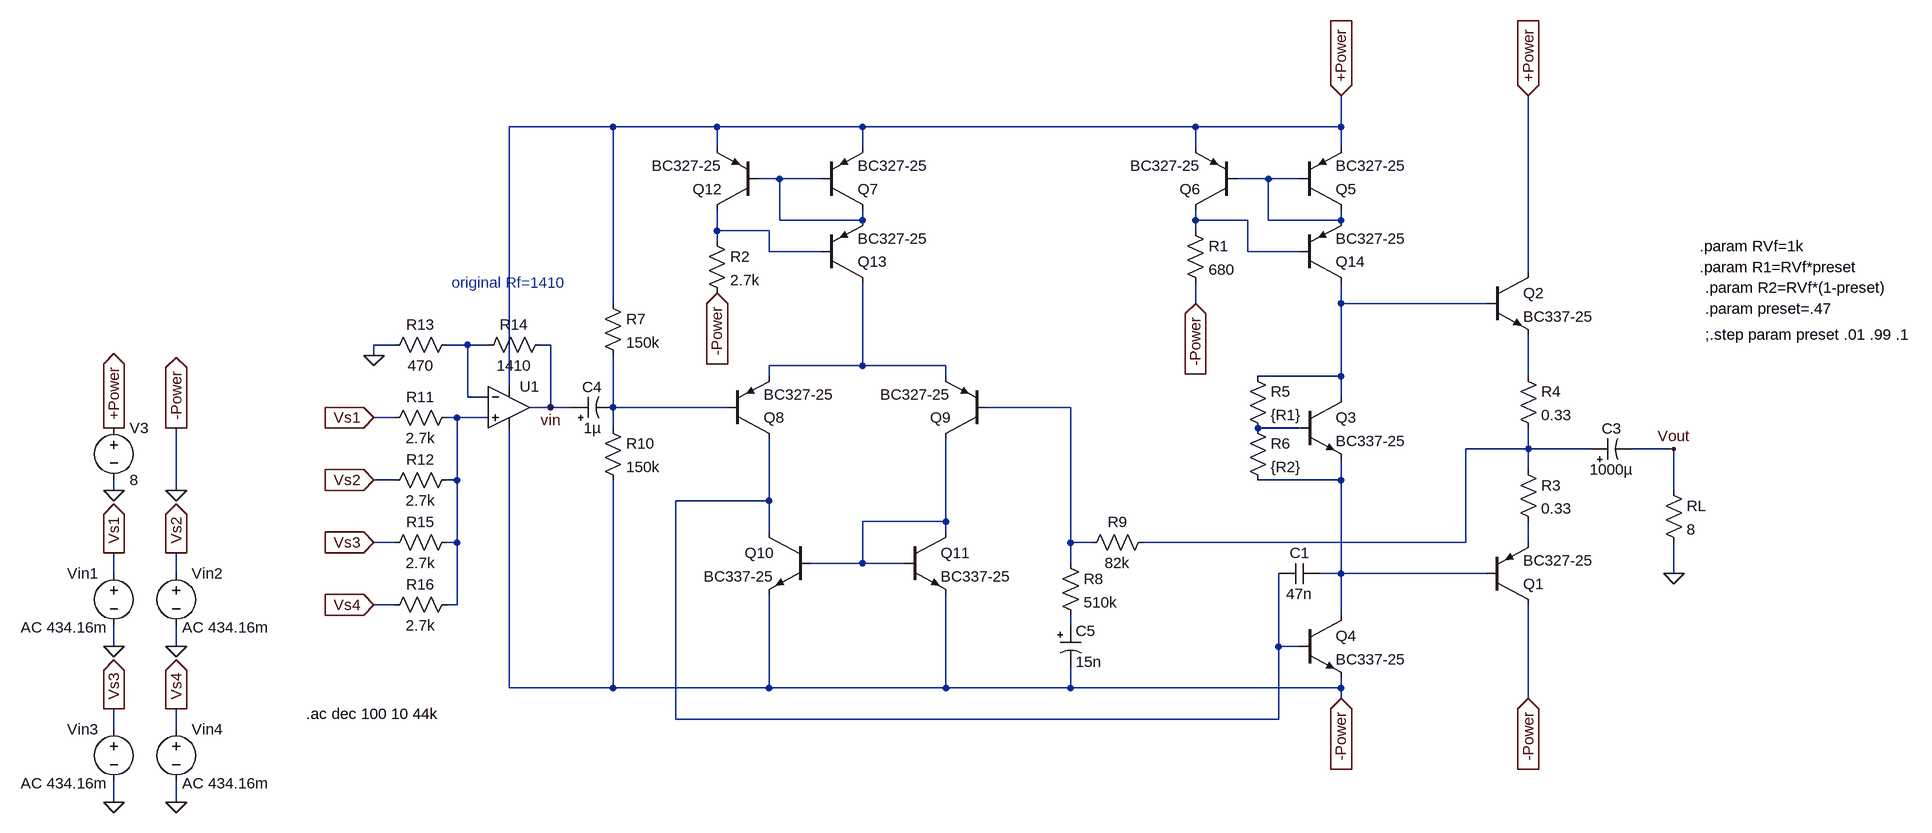
[diagram p0: schematic Headphones Amp Freq.asc]
Headphones Amp Freq.asc, the LTspice schematic file:
Version 4.1
SHEET 1 7092 1032
WIRE -624 -448 -784 -448
WIRE -464 -448 -624 -448
WIRE -240 -448 -464 -448
WIRE 272 -448 -240 -448
WIRE 496 -448 496 -496
WIRE 496 -448 272 -448
WIRE -464 -416 -464 -448
WIRE -240 -416 -240 -448
WIRE 272 -416 272 -448
WIRE 496 -416 496 -448
WIRE -368 -368 -400 -368
WIRE -304 -368 -368 -368
WIRE 384 -368 336 -368
WIRE 432 -368 384 -368
WIRE -368 -304 -368 -368
WIRE -240 -304 -240 -320
WIRE -240 -304 -368 -304
WIRE 272 -304 272 -320
WIRE 352 -304 272 -304
WIRE 384 -304 384 -368
WIRE 496 -304 496 -320
WIRE 496 -304 384 -304
WIRE -464 -288 -464 -320
WIRE -384 -288 -464 -288
WIRE 272 -288 272 -304
WIRE -464 -272 -464 -288
WIRE -384 -256 -384 -288
WIRE -304 -256 -384 -256
WIRE 352 -256 352 -304
WIRE 432 -256 352 -256
WIRE 784 -224 784 -496
WIRE -624 -176 -624 -448
WIRE 272 -176 272 -208
WIRE 496 -176 496 -208
WIRE 720 -176 496 -176
WIRE -960 -112 -992 -112
WIRE -848 -112 -880 -112
WIRE -816 -112 -848 -112
WIRE -720 -112 -736 -112
WIRE -992 -96 -992 -112
WIRE -240 -80 -240 -208
WIRE -240 -80 -384 -80
WIRE -112 -80 -240 -80
WIRE -384 -64 -384 -80
WIRE -112 -64 -112 -80
WIRE 496 -64 496 -176
WIRE 496 -64 368 -64
WIRE 784 -64 784 -128
WIRE -784 -48 -784 -448
WIRE -848 -32 -848 -112
WIRE -816 -32 -848 -32
WIRE 496 -32 496 -64
WIRE -720 -16 -720 -112
WIRE -720 -16 -752 -16
WIRE -688 -16 -720 -16
WIRE -624 -16 -624 -96
WIRE -624 -16 -640 -16
WIRE -448 -16 -624 -16
WIRE 80 -16 -48 -16
WIRE -960 0 -992 0
WIRE -864 0 -880 0
WIRE -816 0 -864 0
WIRE -624 16 -624 -16
WIRE 432 16 368 16
WIRE 784 48 784 16
WIRE 784 48 688 48
WIRE 880 48 784 48
WIRE 1008 48 944 48
WIRE 784 80 784 48
WIRE -960 96 -992 96
WIRE -864 96 -864 0
WIRE -864 96 -880 96
WIRE 496 96 496 64
WIRE 496 96 368 96
WIRE -1392 112 -1392 96
WIRE -1296 112 -1296 16
WIRE 1008 112 1008 48
WIRE -384 128 -384 32
WIRE -384 128 -528 128
WIRE -112 160 -112 32
WIRE -112 160 -240 160
WIRE -384 176 -384 128
WIRE -112 176 -112 160
WIRE -960 192 -992 192
WIRE -864 192 -864 96
WIRE -864 192 -880 192
WIRE 80 192 80 -16
WIRE 112 192 80 192
WIRE 688 192 688 48
WIRE 688 192 192 192
WIRE 784 192 784 160
WIRE -240 224 -240 160
WIRE -240 224 -320 224
WIRE -176 224 -240 224
WIRE 80 224 80 192
WIRE -1392 240 -1392 208
WIRE -1296 240 -1296 208
WIRE 496 240 496 96
WIRE 496 240 464 240
WIRE 720 240 496 240
WIRE 1008 240 1008 192
WIRE -960 288 -992 288
WIRE -864 288 -864 192
WIRE -864 288 -880 288
WIRE 496 304 496 240
WIRE 80 320 80 304
WIRE -1392 352 -1392 320
WIRE -1296 352 -1296 320
WIRE 400 352 400 240
WIRE 432 352 400 352
WIRE -784 416 -784 16
WIRE -624 416 -624 96
WIRE -624 416 -784 416
WIRE -384 416 -384 272
WIRE -384 416 -624 416
WIRE -112 416 -112 272
WIRE -112 416 -384 416
WIRE 80 416 80 384
WIRE 80 416 -112 416
WIRE 496 416 496 400
WIRE 496 416 80 416
WIRE 496 432 496 416
WIRE 784 432 784 288
WIRE -528 464 -528 128
WIRE 400 464 400 352
WIRE 400 464 -528 464
WIRE -1392 480 -1392 448
WIRE -1296 480 -1296 448
WIRE -1392 592 -1392 560
WIRE -1296 592 -1296 560
FLAG -1296 16 -Power
IOPIN -1296 16 Out
FLAG -1392 16 +Power
IOPIN -1392 16 Out
FLAG -1392 112 0
FLAG -1296 112 0
FLAG -1392 352 0
FLAG -1392 208 Vs1
IOPIN -1392 208 Out
FLAG 496 -496 +Power
IOPIN 496 -496 In
FLAG 784 -496 +Power
IOPIN 784 -496 In
FLAG 784 432 -Power
IOPIN 784 432 In
FLAG 1008 240 0
FLAG -992 0 Vs1
IOPIN -992 0 In
FLAG 496 432 -Power
IOPIN 496 432 In
FLAG 1008 48 Vout
FLAG -1296 352 0
FLAG -1296 208 Vs2
IOPIN -1296 208 Out
FLAG -992 96 Vs2
IOPIN -992 96 In
FLAG -992 -96 0
FLAG -1392 592 0
FLAG -1392 448 Vs3
IOPIN -1392 448 Out
FLAG -1296 592 0
FLAG -1296 448 Vs4
IOPIN -1296 448 Out
FLAG -992 192 Vs3
IOPIN -992 192 In
FLAG -992 288 Vs4
IOPIN -992 288 In
FLAG -720 -16 vin
FLAG 272 -176 -Power
IOPIN 272 -176 In
FLAG -464 -192 -Power
IOPIN -464 -192 In
SYMBOL voltage -1392 0 R0
WINDOW 123 0 0 Left 0
WINDOW 39 0 0 Left 0
SYMATTR InstName V3
SYMATTR Value 8
SYMBOL voltage -1392 224 M0
WINDOW 123 0 0 Left 0
WINDOW 39 0 0 Left 0
WINDOW 3 9 99 Left 2
SYMATTR Value AC 434.16m
SYMATTR InstName Vin1
SYMBOL res 992 96 R0
SYMATTR InstName RL
SYMATTR Value 8
SYMBOL res 768 64 R0
SYMATTR InstName R3
SYMATTR Value 0.33
SYMBOL res 768 -80 R0
SYMATTR InstName R4
SYMATTR Value 0.33
SYMBOL pnp 720 288 M180
SYMATTR InstName Q1
SYMATTR Value BC327-25
SYMBOL npn 720 -224 R0
SYMATTR InstName Q2
SYMATTR Value BC337-25
SYMBOL npn 432 -32 R0
SYMATTR InstName Q3
SYMATTR Value BC337-25
SYMBOL res 352 -80 R0
SYMATTR InstName R5
SYMATTR Value {R1}
SYMBOL res 352 0 R0
SYMATTR InstName R6
SYMATTR Value {R2}
SYMBOL npn 432 304 R0
SYMATTR InstName Q4
SYMATTR Value BC337-25
SYMBOL cap 464 224 R90
WINDOW 0 0 32 VBottom 2
WINDOW 3 32 32 VTop 2
SYMATTR InstName C1
SYMATTR Value 47n
SYMBOL pnp 432 -320 M180
SYMATTR InstName Q5
SYMATTR Value BC327-25
SYMBOL pnp 336 -320 R180
SYMATTR InstName Q6
SYMATTR Value BC327-25
SYMBOL res 256 -304 R0
SYMATTR InstName R1
SYMATTR Value 680
SYMBOL pnp -448 32 M180
SYMATTR InstName Q8
SYMATTR Value BC327-25
SYMBOL pnp -48 32 R180
SYMATTR InstName Q9
SYMATTR Value BC327-25
SYMBOL npn -320 176 M0
SYMATTR InstName Q10
SYMATTR Value BC337-25
SYMBOL npn -176 176 R0
SYMATTR InstName Q11
SYMATTR Value BC337-25
SYMBOL res 64 208 R0
SYMATTR InstName R8
SYMATTR Value 510k
SYMBOL res 208 176 R90
WINDOW 0 0 56 VBottom 2
WINDOW 3 32 56 VTop 2
SYMATTR InstName R9
SYMATTR Value 82k
SYMBOL pnp -304 -320 M180
SYMATTR InstName Q7
SYMATTR Value BC327-25
SYMBOL pnp -400 -320 R180
SYMATTR InstName Q12
SYMATTR Value BC327-25
SYMBOL res -480 -288 R0
SYMATTR InstName R2
SYMATTR Value 2.7k
SYMBOL res -640 -192 R0
SYMATTR InstName R7
SYMATTR Value 150k
SYMBOL res -640 0 R0
SYMATTR InstName R10
SYMATTR Value 150k
SYMBOL polcap 880 64 R270
WINDOW 0 32 32 VTop 2
WINDOW 3 0 32 VBottom 2
SYMATTR InstName C3
SYMATTR Value 1000µ
SYMBOL voltage -1296 224 R0
WINDOW 123 0 0 Left 0
WINDOW 39 0 0 Left 0
WINDOW 3 9 99 Left 2
SYMATTR Value AC 434.16m
SYMATTR InstName Vin2
SYMBOL res -864 -16 R90
WINDOW 0 0 56 VBottom 2
WINDOW 3 32 56 VTop 2
SYMATTR InstName R11
SYMATTR Value 2.7k
SYMBOL res -864 80 R90
WINDOW 0 0 56 VBottom 2
WINDOW 3 32 56 VTop 2
SYMATTR InstName R12
SYMATTR Value 2.7k
SYMBOL OpAmps\\UniversalOpAmp -784 -16 R0
SYMATTR InstName U1
SYMBOL res -864 -128 R90
WINDOW 0 0 56 VBottom 2
WINDOW 3 32 56 VTop 2
SYMATTR InstName R13
SYMATTR Value 470
SYMBOL res -720 -128 R90
WINDOW 0 0 56 VBottom 2
WINDOW 3 32 56 VTop 2
SYMATTR InstName R14
SYMATTR Value 1410
SYMBOL voltage -1392 464 M0
WINDOW 123 0 0 Left 0
WINDOW 39 0 0 Left 0
WINDOW 3 9 99 Left 2
SYMATTR Value AC 434.16m
SYMATTR InstName Vin3
SYMBOL voltage -1296 464 R0
WINDOW 123 0 0 Left 0
WINDOW 39 0 0 Left 0
WINDOW 3 9 99 Left 2
SYMATTR Value AC 434.16m
SYMATTR InstName Vin4
SYMBOL res -864 176 R90
WINDOW 0 0 56 VBottom 2
WINDOW 3 32 56 VTop 2
SYMATTR InstName R15
SYMATTR Value 2.7k
SYMBOL res -864 272 R90
WINDOW 0 0 56 VBottom 2
WINDOW 3 32 56 VTop 2
SYMATTR InstName R16
SYMATTR Value 2.7k
SYMBOL polcap -688 0 R270
WINDOW 0 32 32 VTop 2
WINDOW 3 0 32 VBottom 2
SYMATTR InstName C4
SYMATTR Value 1µ
SYMBOL polcap 64 320 R0
SYMATTR InstName C5
SYMATTR Value 15n
SYMBOL pnp -304 -208 M180
SYMATTR InstName Q13
SYMATTR Value BC327-25
SYMBOL pnp 432 -208 M180
SYMATTR InstName Q14
SYMATTR Value BC327-25
TEXT 1048 -264 Left 2 !.param RVf=1k
TEXT 1048 -232 Left 2 !.param R1=RVf*preset
TEXT 1056 -200 Left 2 !.param R2=RVf*(1-preset)
TEXT 1056 -128 Left 2 !;.step param preset .01 .99 .1
TEXT 1056 -168 Left 2 !.param preset=.47
TEXT -872 -208 Left 2 ;original Rf=1410
TEXT -1096 456 Left 2 !.ac dec 100 10 44k

The netlist it stands for:
* Headphones Amp Freq.asc
V3 +Power 0 8
Vin1 Vs1 0 AC 434.16m
RL Vout 0 8
R3 N013 N017 0.33
R4 N008 N013 0.33
Q1 0 N014 N017 0 BC327-25
Q2 +Power N005 N008 0 BC337-25
Q3 N005 N012 N014 0 BC337-25
R5 N005 N012 {R1}
R6 N012 N014 {R2}
Q4 N014 N015 0 0 BC337-25
C1 N014 N015 47n
Q5 N002 N002 +Power 0 BC327-25
Q6 N003 N002 +Power 0 BC327-25
R1 N003 0 680
Q8 N015 N009 N007 0 BC327-25
Q9 N016 N010 N007 0 BC327-25
Q10 N015 N016 0 0 BC337-25
Q11 N016 N016 0 0 BC337-25
R8 N010 N018 510k
R9 N013 N010 82k
Q7 N001 N001 +Power 0 BC327-25
Q12 N004 N001 +Power 0 BC327-25
R2 N004 0 2.7k
R7 +Power N009 150k
R10 N009 0 150k
C3 N013 Vout 1000µ
Vin2 Vs2 0 AC 434.16m
R11 N011 Vs1 2.7k
R12 N011 Vs2 2.7k
X§U1 N011 N006 +Power 0 vin level1 Avol=1Meg GBW=10Meg Vos=0 En=0 Enk=0 In=0 Ink=0 Rin=500Meg  ; pins In+ In- V+ V- OUT
R13 N006 0 470
R14 vin N006 1410
Vin3 Vs3 0 AC 434.16m
Vin4 Vs4 0 AC 434.16m
R15 N011 Vs3 2.7k
R16 N011 Vs4 2.7k
C4 vin N009 1µ
C5 N018 0 15n
Q13 N007 N004 N001 0 BC327-25
Q14 N005 N003 N002 0 BC327-25
.model NPN NPN
.model PNP PNP
.lib standard.bjt
.param RVf=1k
.param R1=RVf*preset
.param R2=RVf*(1-preset)
;.step param preset .01 .99 .1
.param preset=.47
* original Rf=1410
.ac dec 100 10 44k
.lib UniversalOpAmp1.lib
.backanno
.end